# EAGLE design seeker md board (EAGLE 9.6.2)
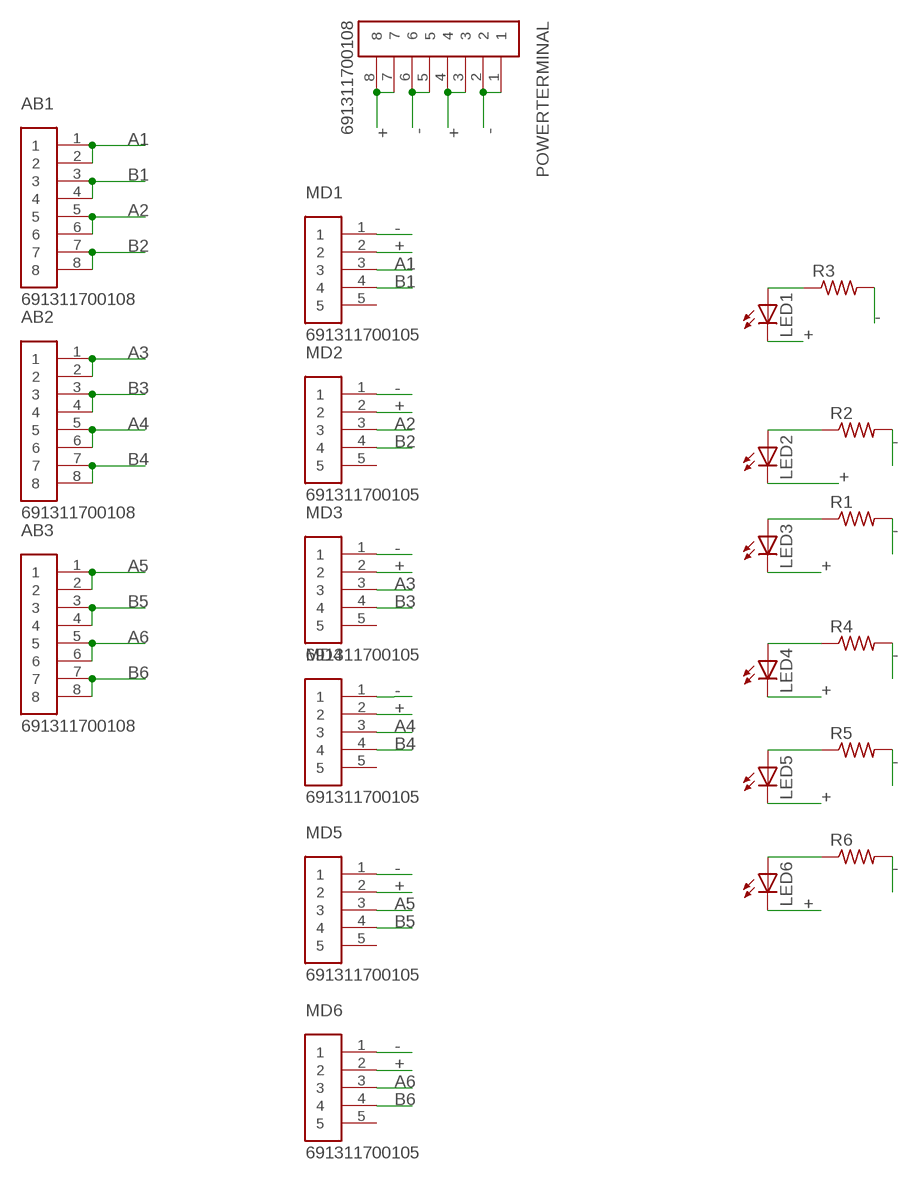
[diagram p0: schematic, sheet 1]

## Parts
AB1  691311700108  [TERMINALBLOCK_PLUGGABLE-8-5MM]
AB2  691311700108  [TERMINALBLOCK_PLUGGABLE-8-5MM]
AB3  691311700108  [TERMINALBLOCK_PLUGGABLE-8-5MM]
LED1  LEDLZR181  [LZR181]
LED2  LEDLZR181  [LZR181]
LED3  LEDLZR181  [LZR181]
LED4  LEDLZR181  [LZR181]
LED5  LEDLZR181  [LZR181]
LED6  LEDLZR181  [LZR181]
MD1  691311700105  [TERMINALBLOCK_PLUGGABLE-5-5MM]
MD2  691311700105  [TERMINALBLOCK_PLUGGABLE-5-5MM]
MD3  691311700105  [TERMINALBLOCK_PLUGGABLE-5-5MM]
MD4  691311700105  [TERMINALBLOCK_PLUGGABLE-5-5MM]
MD5  691311700105  [TERMINALBLOCK_PLUGGABLE-5-5MM]
MD6  691311700105  [TERMINALBLOCK_PLUGGABLE-5-5MM]
POWERTERMINAL  691311700108  [TERMINALBLOCK_PLUGGABLE-8-5MM]
R1  R-US_0204/5  [0204/5]
R2  R-US_0204/5  [0204/5]
R3  R-US_0204/5  [0204/5]
R4  R-US_0204/5  [0204/5]
R5  R-US_0204/5  [0204/5]
R6  R-US_0204/5  [0204/5]

## Nets
+: LED1.K(C) LED2.K(C) LED3.K(C) LED4.K(C) LED5.K(C) LED6.K(C) MD1.2 MD2.2 MD3.2 MD4.2 MD5.2 MD6.2 POWERTERMINAL.3 POWERTERMINAL.4 POWERTERMINAL.7 POWERTERMINAL.8
-: MD1.1 MD2.1 MD3.1 MD4.1 MD5.1 MD6.1 POWERTERMINAL.1 POWERTERMINAL.2 POWERTERMINAL.5 POWERTERMINAL.6 R1.2 R2.2 R3.2 R4.2 R5.2 R6.2
A1: AB1.1 AB1.2 MD1.3
A2: AB1.5 AB1.6 MD2.3
A3: AB2.1 AB2.2 MD3.3
A4: AB2.5 AB2.6 MD4.3
A5: AB3.1 AB3.2 MD5.3
A6: AB3.5 AB3.6 MD6.3
B1: AB1.3 AB1.4 MD1.4
B2: AB1.7 AB1.8 MD2.4
B3: AB2.3 AB2.4 MD3.4
B4: AB2.7 AB2.8 MD4.4
B5: AB3.3 AB3.4 MD5.4
B6: AB3.7 AB3.8 MD6.4
N$1: LED1.A R3.1
N$2: LED2.A R2.1
N$3: LED3.A R1.1
N$4: LED4.A R4.1
N$5: LED5.A R5.1
N$6: LED6.A R6.1
Unconnected: MD1.5 MD2.5 MD3.5 MD4.5 MD5.5 MD6.5

## Library data of the parts
AB1-AB3 POWERTERMINAL = Terminal Blocks FOR USE IN PB:691311700108: 5.00MM CLOSE VERTICAL PCB HEADER WR-TBL Manufacturer's datasheet <https://katalog.we-online.com/en/em/TBL_5_00_3117_CLOSE_VERTICAL_PCB_HEADER_69131170010X>; CREATED_BY: PCBLayout.com; DIGIKEY_PART_NO: 732-2792-ND; MANUFACTURER: WURTH ELEKTRONIK; MPN: 691311700108
LED1-LED6 = adafruit:LED: LED OSRAM: - CHIPLED LG R971, LG N971, LY N971, LG Q971, LY Q971, LO R971, LY R971 LH N974, LH R974 LS Q976, LO Q976, LY Q976 LO Q996 - Hyper CHIPLED LW Q18S LB Q993, LB Q99A, LB R99A - SideLED LS A670, LO A670, LY A670, LG A670, LP A670 LB A673, LV A673, LT A673, LW A673 LH A674 LY A675 LS A676, LA A676, LO A676, LY A676, LW A676 LS A679, LY A679, LG A679 - Hyper Micro SIDELED® LS Y876, LA Y876, LO Y876, LY Y876 LT Y87S - SmartLED LW L88C, LW L88S LB L89C, LB L89S, LG L890 LS L89K, LO L89K, LY L89K LS L896, LA L896, LO L896, LY L896 - TOPLED LS T670, LO T670, LY T670, LG T670, LP T670 LSG T670, LSP T670, LSY T670, LOP T670, LYG T670 LG T671, LOG T671, LSG T671 LB T673, LV T673, LT T673, LW T673 LH T674 LS T676, LA T676, LO T676, LY T676, LB T676, LH T676, LSB T676, LW T676 LB T67C, LV T67C, LT T67C, LS T67K, LO T67K, LY T67K, LW E67C LS E67B, LA E67B, LO E67B, LY E67B, LB E67C, LV E67C, LT E67C LW T67C LS T679, LY T679, LG T679 LS T770, LO T770, LY T770, LG T770, LP T770 LB T773, LV T773, LT T773, LW T773 LH T774 LS E675, LA E675, LY E675, LS T675 LS T776, LA T776, LO T776, LY T776, LB T776 LHGB T686 LT T68C, LB T68C - Hyper Mini TOPLED® LB M676 - Mini TOPLED Santana® LG M470 LS M47K, LO M47K, LY M47K Source: http://www.osram.convergy.de/
MD1-MD6 = Terminal Blocks FOR USE IN PB:691311700105: 5.00MM CLOSE VERTICAL PCB HEADER Manufacturer's datasheet <https://katalog.we-online.com/em/datasheet/6913117001xx.pdf>; CREATED_BY: PCBLayout.com; DIGIKEY_PART_NO: 732-2790-ND; MANUFACTURER: WURTH ELEKTRONIK; MPN: 691311700105
R1-R6 = resistor:R-US_: RESISTOR, American symbol

## Board
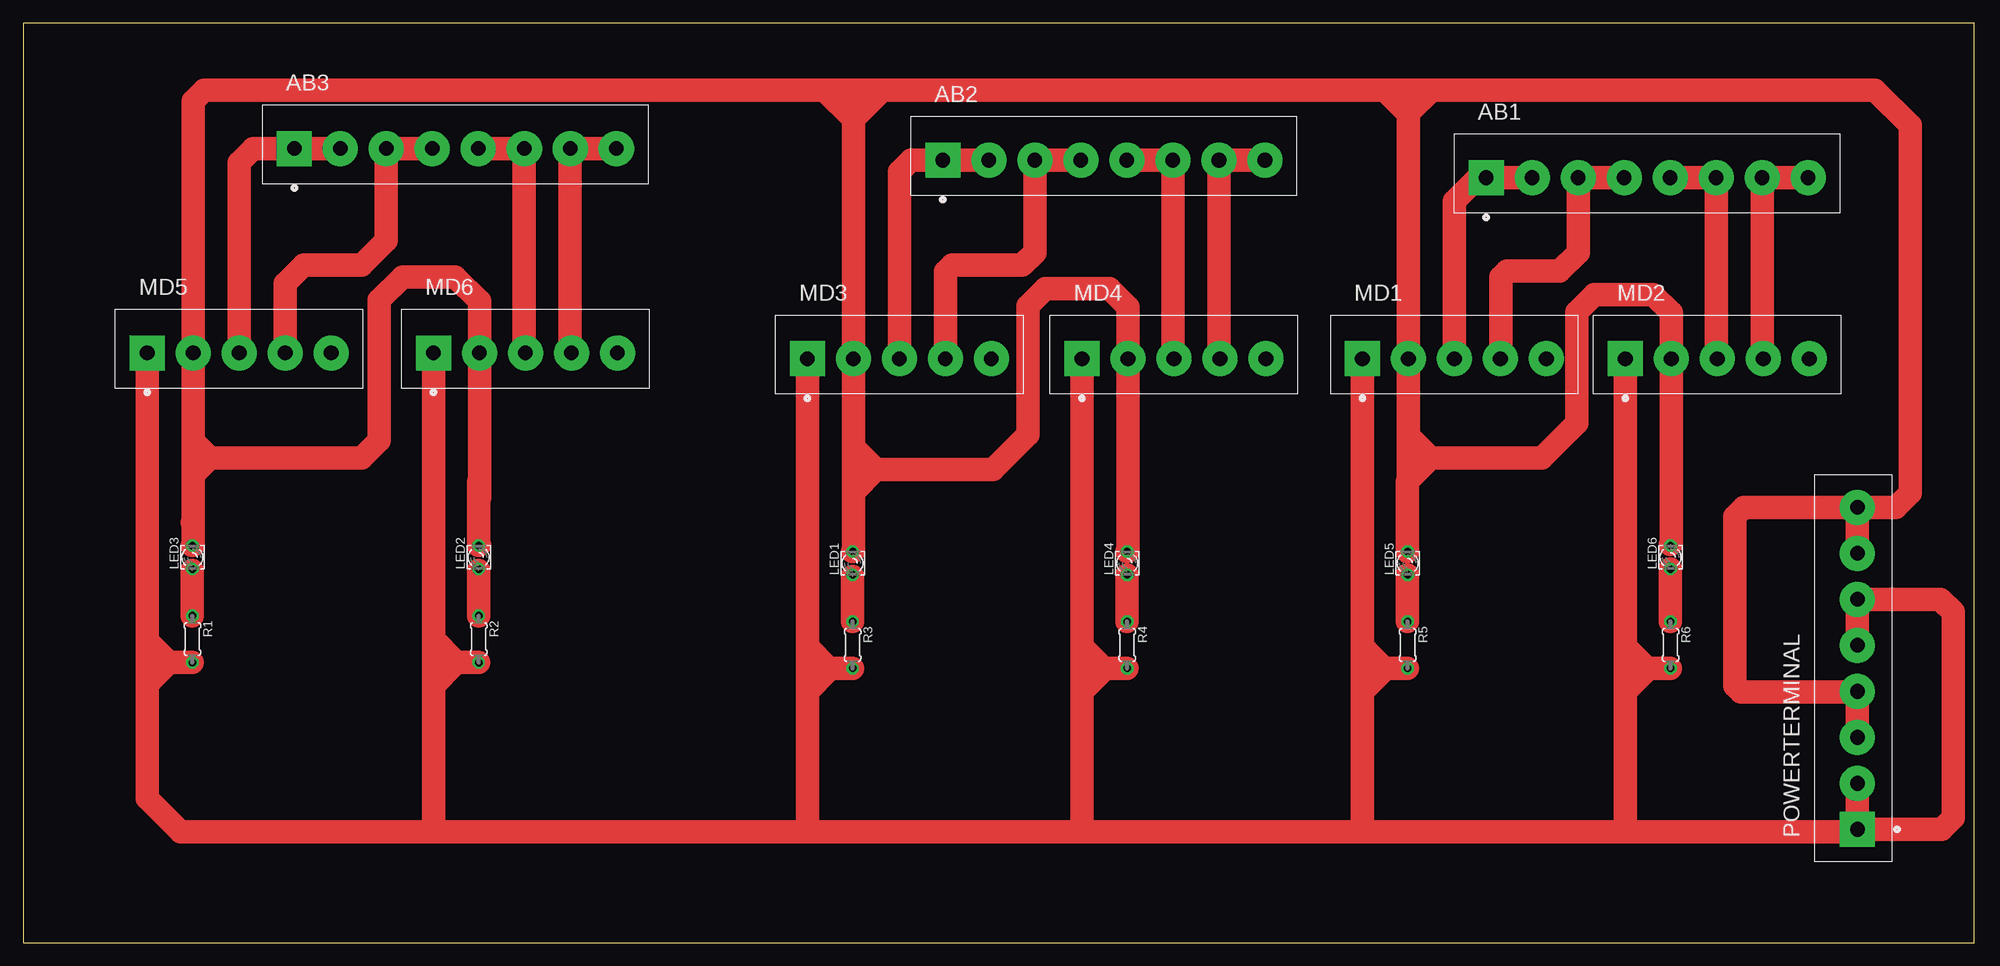
[diagram p1: board, top side]

Size 212.07 x 100 mm. Coordinates in mm from the lower left corner, seen from the top.
Outline: 0,0 212.07,0 212.07,100 0,100 0,0
Copper layers (1*16): Top 0.035mm / dielectric 1.5mm / Bottom 0.035mm
Design rules "default": minimum track width 6mil, minimum drill 0.35mm, track to track 6mil, track to pad 6mil, pad to pad 6mil, via to via 6mil, smd to smd 6mil, copper to edge 40mil, drill to drill 6mil, minimum pad ring 10mil, minimum via ring 8mil, stop-mask expansion 4mil, vias tented up to drill 0mil, thermal gap 10mil

### Footprints (pad centres in the part's own frame; a part is rotated, then mirrored left to right if it is on the bottom)
TERMINALBLOCK_PLUGGABLE-8-5MM = drill 1.6 pad 3.81 square: 1 -17.5,0 | drill 1.6 pad 3.81: 2 -12.5,0; 3 -7.5,0; 4 -2.5,0; 5 2.5,0; 6 7.5,0; 7 12.5,0; 8 17.5,0
LZR181 = drill 0.813 octagon: A -1.27,0; K 1.27,0
TERMINALBLOCK_PLUGGABLE-5-5MM = drill 1.6 pad 3.81 square: 1 -10,0 | drill 1.6 pad 3.81: 2 -5,0; 3 0,0; 4 5,0; 5 10,0
0204/5 = drill 0.813 octagon: 1 -2.54,0; 2 2.54,0

### Placement (x,y rotation side)
AB1  176.53,83.19 0 top
AB2  117.47,85.09 0 top
AB3  46.99,86.36 0 top
LED1  90.17,41.27 90 top
LED2  49.53,41.91 90 top
LED3  18.41,41.91 90 top
LED4  120.01,41.27 90 top
LED5  150.5,41.27 90 top
LED6  179.07,41.91 90 top
MD1  155.57,63.5 0 top
MD2  184.15,63.5 0 top
MD3  95.25,63.5 0 top
MD4  125.09,63.5 0 top
MD5  23.49,64.14 0 top
MD6  54.61,64.14 0 top
POWERTERMINAL  199.39,29.85 90 top
R1  18.41,33.02 270 top
R2  49.53,33.02 270 top
R3  90.17,32.38 270 top
R4  120.01,32.38 270 top
R5  150.5,32.38 270 top
R6  179.07,32.38 270 top

### Tracks (layer width: path | path; a pad name or v marks a point on that pad's centre or on a via)
+  (1 unrouted)
  Top 0.813: 176.49,92.04 177.16,92.71
  Top 2.54: POWERTERMINAL.8 187.04,47.34 186.05,46.35 186.05,27.94 186.69,27.31 199.35,27.31 | 199.35,27.31 POWERTERMINAL.4 | POWERTERMINAL.3 199.39,27.27 199.35,27.31 | POWERTERMINAL.7 POWERTERMINAL.8 | POWERTERMINAL.8 203.55,47.34 205.1,48.89 205.1,88.9 201.29,92.71 177.16,92.71 153.12,92.71 | 153.12,92.71 151.13,92.71 | 151.13,92.71 147.95,92.71 | 147.95,92.71 93.42,92.71 | 93.42,92.71 90.17,92.71 | 90.17,92.71 87.07,92.71 | 87.07,92.71 19.68,92.71 18.49,91.52 MD5.2 18.49,54.53 | 90.25,89.54 MD3.2 90.25,53.89 | 90.25,89.54 90.25,92.63 90.17,92.71 | 18.49,54.53 20.32,52.7 | 20.32,52.7 36.83,52.7 38.73,54.61 38.73,69.85 41.27,72.39 46.99,72.39 49.61,69.77 MD6.2 49.61,50.16 | 90.25,53.89 92.71,51.43 | 92.71,51.43 105.41,51.43 109.22,55.24 109.22,69.22 111.12,71.12 118.11,71.12 120.09,69.14 MD4.2 120.09,42.62 LED4.K | 150.57,55.16 MD1.2 150.57,90.17 | 150.57,55.16 153.03,52.7 | 153.03,52.7 165.1,52.7 168.91,56.52 168.91,68.58 170.81,70.48 177.16,70.48 179.15,68.5 MD2.2 179.15,43.41 179.07,43.33 | 150.57,90.17 150.57,92.16 151.13,92.71 | 49.61,50.16 49.61,48.34 | 49.61,43.26 LED2.K 49.53,50.09 49.61,50.16 | 18.49,54.53 18.49,52.7 | 18.49,52.7 18.49,50.88 | 18.49,50.88 18.49,45.8 | 18.49,45.8 18.41,45.72 | 18.49,45.8 18.49,43.26 LED3.K | 20.32,52.7 18.49,50.88 | 20.32,52.7 18.49,52.7 | 90.25,53.89 90.25,51.43 | 90.25,51.43 90.25,48.98 | 90.25,48.98 90.25,42.62 LED1.K | 150.57,55.16 150.57,52.7 | 150.57,52.7 150.57,50.24 | 153.03,52.7 150.57,52.7 | 153.03,52.7 150.57,50.24 | 92.71,51.43 90.25,51.43 | 92.71,51.43 90.25,48.98 | 150.57,90.17 153.12,92.71 | 150.57,90.17 150.5,90.17 147.95,92.71 | 90.25,89.54 93.42,92.71
  Top 2.54: 90.25,89.54 87.07,92.71 | LED5.K 150.5,50.16 150.57,50.24
-
  Top 2.54: POWERTERMINAL.1 208.56,12.35 209.78,13.57 209.78,35.96 208.4,37.34 POWERTERMINAL.6 POWERTERMINAL.5 | POWERTERMINAL.1 POWERTERMINAL.2 | MD5.1 13.49,32.86 | 13.49,32.86 13.49,30.48 | 13.49,30.48 13.49,28.58 | 13.49,28.58 13.49,15.71 17.14,12.06 44.45,12.06 | POWERTERMINAL.1 199.11,12.06 173.99,12.06 | 44.45,12.06 85.09,12.06 | 85.09,12.06 115.57,12.06 | 115.57,12.06 146.05,12.06 | 146.05,12.06 173.99,12.06 | MD3.1 85.25,32.23 | 85.25,32.23 85.25,29.85 | 85.25,29.85 85.25,27.31 | 85.25,27.31 85.25,12.22 85.09,12.06 | MD1.1 145.57,31.75 | 145.57,31.75 145.57,29.85 | 145.57,29.85 145.57,27.31 | 145.57,27.31 145.57,12.86 145.41,12.7 146.05,12.06 | MD4.1 115.09,32.23 | 115.09,32.23 115.09,29.85 | 115.09,29.85 115.09,27.31 | 115.09,27.31 115.09,12.54 115.57,12.06 | MD6.1 44.61,33.02 | 44.61,33.02 44.61,30.48 | 44.61,30.48 44.61,27.94 | 44.61,27.94 44.61,12.86 44.45,12.7 44.45,12.06 | MD2.1 174.15,32.23 | 174.15,32.23 174.15,29.85 | 174.15,29.85 174.15,27.31 | 174.15,27.31 174.15,12.86 173.99,12.7 173.99,12.06 | R2.2 46.99,30.48 | 44.61,30.48 46.99,30.48 | R1.2 15.88,30.48 | 13.49,30.48 15.88,30.48 | R3.2 87.63,29.85 | 85.25,29.85 87.63,29.85 | R6.2 176.53,29.85 | 174.15,29.85 176.53,29.85 | R5.2 147.95,29.85 | 147.95,29.85 145.57,29.85 | R4.2 117.47,29.85 | 115.09,29.85 117.47,29.85 | 117.47,29.85 115.09,32.23 | 117.47,29.85 117.47,29.69 115.09,27.31 | 87.63,29.85 85.25,32.23 | 87.63,29.85 87.63,29.69 85.25,27.31 | 46.99,30.48 46.99,30.32 44.61,27.94 | 46.99,30.48 46.99,30.64 44.61,33.02 | 15.88,30.48 13.49,32.86 | 15.88,30.48 13.97,28.58 13.49,28.58 | 147.95,29.85 146.05,31.75 145.57,31.75 | 147.95,29.85 147.95,29.69 145.57,27.31 | 176.53,29.85 174.15,32.23
  Top 2.54: 176.53,29.85 176.53,29.69 174.15,27.31
A1
  Top 2.54: AB1.2 AB1.1 158.12,83.19 155.57,80.65 MD1.3
A2
  Top 2.54: AB1.5 AB1.6 184.03,63.62 MD2.3
A3
  Top 2.54: AB2.2 AB2.1 96.52,85.09 95.25,83.82 MD3.3
A4
  Top 2.54: AB2.5 AB2.6 124.97,63.62 MD4.3
A5
  Top 2.54: AB3.2 AB3.1 25.04,86.36 23.49,84.81 MD5.3
A6
  Top 2.54: AB3.5 AB3.6 54.49,64.25 MD6.3
B1
  Top 2.54: AB1.4 AB1.3 169.03,75.05 167,73.03 161.29,73.03 160.66,72.39 160.66,63.58 MD1.4
B2
  Top 2.54: AB1.8 AB1.7 189.03,63.62 MD2.4
B3
  Top 2.54: AB2.4 AB2.3 109.97,75.05 108.59,73.66 100.97,73.66 100.25,72.95 MD3.4
B4
  Top 2.54: AB2.8 AB2.7 129.97,63.62 MD4.4
B5
  Top 2.54: AB3.4 AB3.3 39.49,76.32 36.83,73.66 30.48,73.66 28.49,71.68 MD5.4
B6
  Top 2.54: AB3.8 AB3.7 59.49,64.25 MD6.4
N$1  (1 unrouted)
  Top 2.54: R3.1 90.17,39.85
N$2  (1 unrouted)
  Top 2.54: R2.1 49.53,40.49
N$3  (1 unrouted)
  Top 2.54: R1.1 18.41,40.49
N$4
  Top 2.54: LED4.A R4.1
N$5
  Top 2.54: R5.1 LED5.A
N$6
  Top 2.54: LED6.A R6.1